# EAGLE design 1881! (EAGLE 6.2)
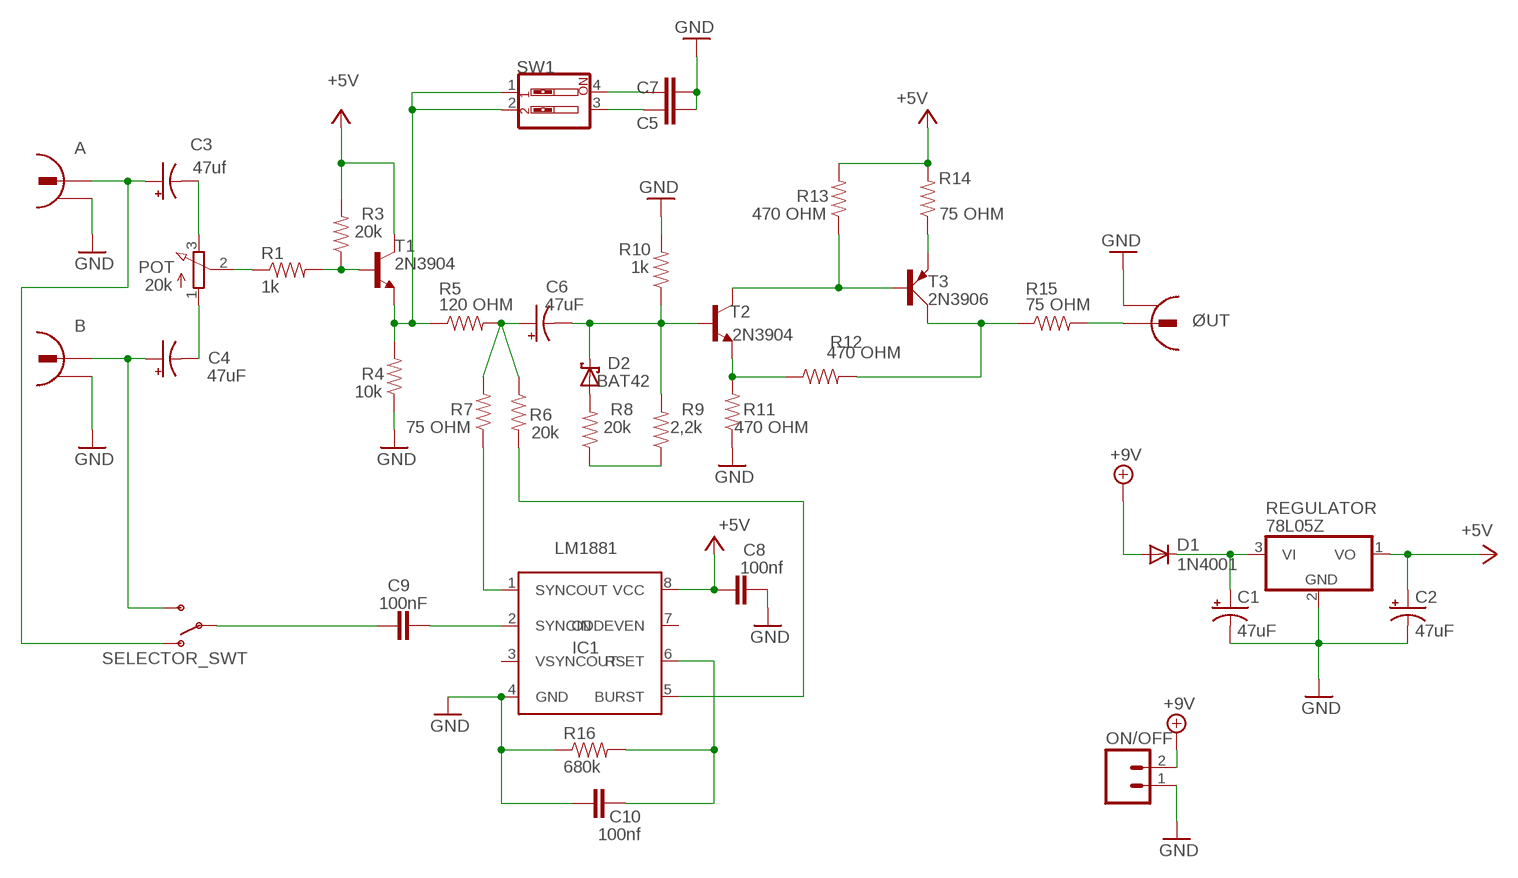
[diagram p0: schematic, sheet 1]

## Parts
A  736880-49  [736880-49]
B  736880-49  [736880-49]
C1  47uF  CAP_POLPTH2  [CPOL-RADIAL-10UF-25V]
C2  47uF  CAP_POLPTH2  [CPOL-RADIAL-10UF-25V]
C3  47uf  CAP_POLPTH2  [CPOL-RADIAL-10UF-25V]
C4  47uF  CAP_POLPTH2  [CPOL-RADIAL-10UF-25V]
C5  CAPPTH2  [CAP-PTH-SMALL2]
C6  47uF  CAP_POLPTH2  [CPOL-RADIAL-10UF-25V]
C7  CAPPTH2  [CAP-PTH-SMALL2]
C8  100nf  CAPPTH2  [CAP-PTH-SMALL2]
C9  100nF  CAPPTH2  [CAP-PTH-SMALL2]
C10  100nf  CAPPTH2  [CAP-PTH-SMALL2]
D1  1N4001  1N4148DO35-7  [DO35-7]
D2  BAT42  [DO35-10]
IC1  LM1881  [DIL08]
ON/OFF  M02POLAR_LOCK  [MOLEX-1X2_LOCK]
POT  20k  3RP/1610N  [3RP/1610N]
R1  1k  RESISTORPTH-1/6W  [1/6W-RES]
R3  20k  RESISTORPTH-1/6W  [1/6W-RES]
R4  10k  RESISTORPTH-1/6W  [1/6W-RES]
R5  120 OHM  RESISTORPTH-1/6W  [1/6W-RES]
R6  20k  RESISTORPTH-1/6W  [1/6W-RES]
R7  75 OHM  RESISTORPTH-1/6W  [1/6W-RES]
R8  20k  RESISTORPTH-1/6W  [1/6W-RES]
R9  2,2k  RESISTORPTH-1/6W  [1/6W-RES]
R10  1k  RESISTORPTH-1/6W  [1/6W-RES]
R11  470 OHM  RESISTORPTH-1/6W  [1/6W-RES]
R12  470 OHM  RESISTORPTH-1/6W  [1/6W-RES]
R13  470 OHM  RESISTORPTH-1/6W  [1/6W-RES]
R14  75 OHM  RESISTORPTH-1/6W  [1/6W-RES]
R15  75 OHM  RESISTORPTH-1/6W  [1/6W-RES]
R16  680k  RESISTORPTH-1/6W  [1/6W-RES]
REGULATOR  78L05Z  [TO92]
SELECTOR_SWT  SWITCH-SPSTPTH  [SWITCH-SPDT]
SW1  SW_DIP-2  [DIPSWITCH-02]
T1  2N3904  [TO92]
T2  2N3904  [TO92]
T3  2N3906  [TO92D]
ØUT  736880-49  [736880-49]

## Nets
+5V: C2.1(+) C8.1 IC1.8(VCC) R3.2 R13.2 R14.2 REGULATOR.1(VO) T1.1(C)
+9V: D1.A ON/OFF.2
GND: A.2 B.2 C1.2(-) C2.2(-) C5.2 C7.2 C8.2 C10.1 IC1.4(GND) ON/OFF.1 R4.1 R10.2 R11.1 R16.1 REGULATOR.2(GND) ØUT.2
N$1: C1.1(+) D1.C REGULATOR.3(VI)
N$2: B.1 C4.1(+) SELECTOR_SWT.3(S)
N$3: A.1 C3.1(+) SELECTOR_SWT.1(O)
N$4: C3.2(-) POT.3(E)
N$5: C4.2(-) POT.1(A)
N$6: POT.2(S) R1.1
N$7: R1.2 R3.1 T1.2(B)
N$8: C6.1(+) R5.2 R6.1 R7.2
N$9: IC1.1(SYNCOUT) R7.1
N$10: D2.A R8.2
N$11: C6.2(-) D2.C R9.2 R10.1 T2.2(B)
N$12: R8.1 R9.1
N$13: R11.2 R12.1 T2.3(E)
N$14: R13.1 T2.1(C) T3.B
N$15: R14.1 T3.E
N$16: R4.2 R5.1 SW1.1 SW1.2 T1.3(E)
N$17: R12.2 R15.1 T3.C
N$18: R15.2 ØUT.1
N$19: C5.1 SW1.3
N$20: C7.1 SW1.4
N$21: IC1.5(BURST) R6.2
N$22: C9.2 IC1.2(SYNCIN)
N$23: C10.2 IC1.6(RSET) R16.2
N$24: C9.1 SELECTOR_SWT.2(P)
Unconnected: A.2@2 B.2@2 IC1.3(VSYNCOUT) IC1.7(ODDEVEN) ØUT.2@2

## Library data of the parts
A B ØUT = con-conrad:736880-49: Cinch Connector ( RCA Jack )
C1-C4 C6 = SparkFun:CAP_POL: Capacitor Polarized These are standard SMD and PTH capacitors. Normally 10uF, 47uF, and 100uF in electrolytic and tantalum varieties. Always verify the external diameter of the through hole cap, it varies with capacity, voltage, and manufacturer. The EIA devices should be standard.
C5 C7-C10 = SparkFun:CAP: Capacitor Standard 0603 ceramic capacitor, and 0.1" leaded capacitor.
D1 = diode:1N4148: DIODE high speed (Philips)
D2 = diode:BAT42: DIODE barrier diode
IC1 = lm1881:LM1881
ON/OFF = SparkFun:M02: Header 2 Standard 2-pin 0.1" header. Use with straight break away headers (SKU : PRT-00116), right angle break away headers (PRT-00553), swiss pins (PRT-00743), machine pins (PRT-00117), and female headers (PRT-00115). Molex polarized connector foot print use with SKU : PRT-08233 with associated crimp pins and housings.
POT = pot:3RP/1610N: 16mm Potentiometer one level Source: http://www.alphapotentiometers.net/html/16mm_pot_2.html
R1 R3-R16 = SparkFun:RESISTOR: Resistor Basic schematic elements and footprints for 0603, 1206, and PTH resistors.
REGULATOR = linear:78*: Positive VOLTAGE REGULATOR Source: http://cache.national.com/ds/LM/LM78L05.pdf http://www.fairchildsemi.com/ds/LM/LM7805.pdf
SELECTOR_SWT = SparkFun:SWITCH-SPST: SPST Switch Simple slide switch. Spark Fun Electronics SKU : COM-00102
SW1 = SparkFun:SW_DIP-2: DIP SWITCH
T1 T2 = transistor:2N3904: NPN TRANSISTOR
T3 = transistor-small-signal:2N3906: PNP TRANSISTOR

## Board
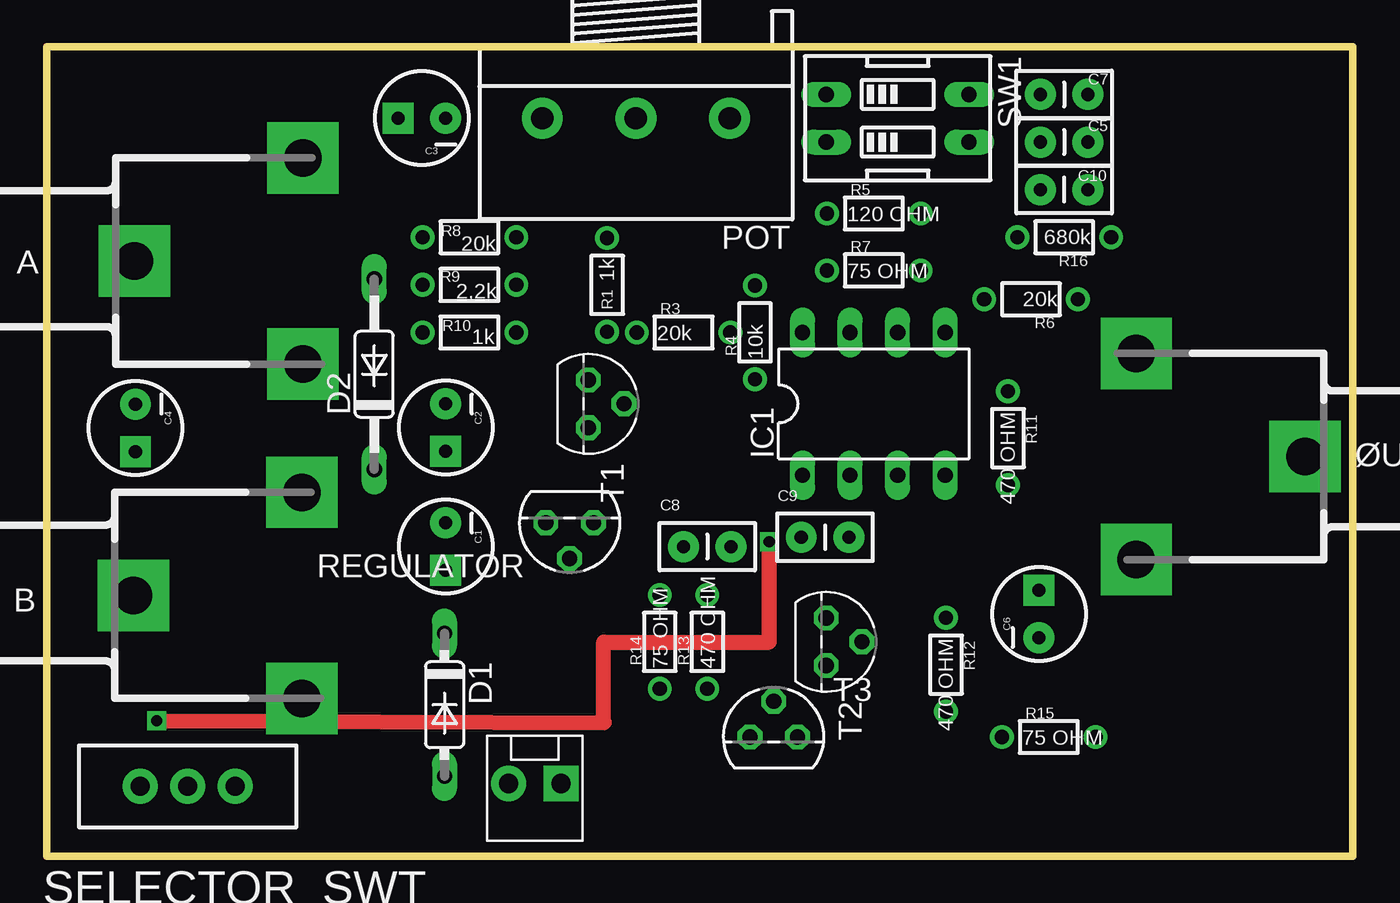
[diagram p1: board, top side]
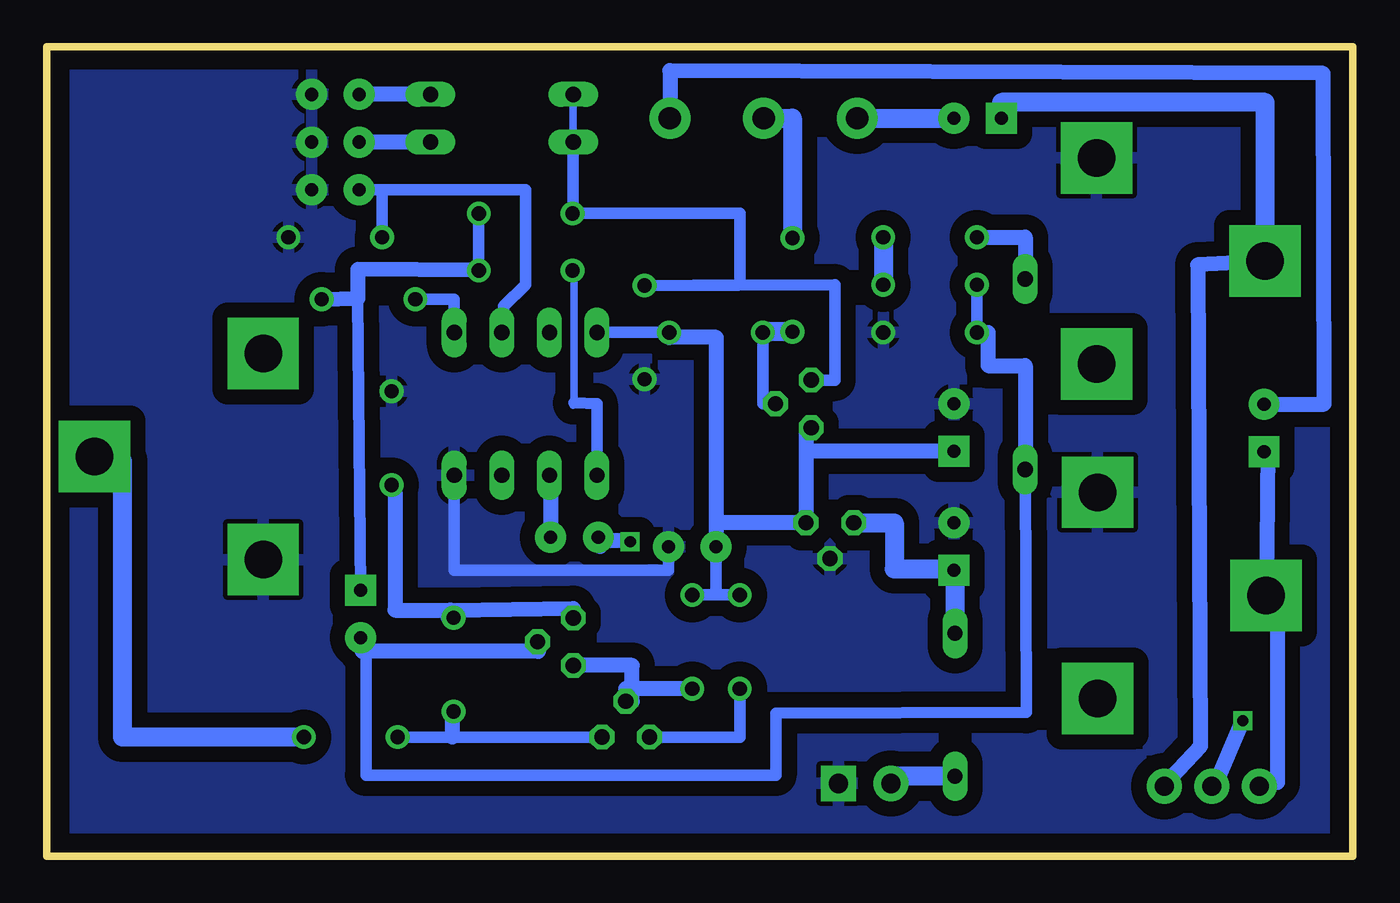
[diagram p2: board, bottom side, seen from below]

Size 69.71 x 43.18 mm. Coordinates in mm from the lower left corner, seen from the top.
Outline: 69.71,43.18 69.71,0 0,0 0,43.18 69.71,43.18
Copper layers (1*16): Top 0.035mm / dielectric 1.5mm / Bottom 0.035mm
Design rules: minimum track width 10mil, minimum drill 24mil, track to track 8mil, track to pad 8mil, pad to pad 8mil, via to via 8mil, smd to smd 8mil, copper to edge 40mil, drill to drill 8mil, minimum pad ring 10mil, minimum via ring 8mil, stop-mask expansion 4mil, vias tented up to drill 0mil, thermal gap 10mil

### Footprints (pad centres in the part's own frame; a part is rotated, then mirrored left to right if it is on the bottom)
736880-49 = drill 2 pad 3.81 square: 1 -3.92,0; 2 5.08,5.5; 2@2 5.08,-5.5
CPOL-RADIAL-10UF-25V = drill 0.7 pad 1.651 square: 1 1.27,0 | drill 0.7 pad 1.651: 2 -1.27,0
CAP-PTH-SMALL2 = drill 0.7 pad 1.651: 1 0,0; 2 2.54,0
DO35-7 = drill 0.813 long: A 3.81,0; C -3.81,0
DO35-10 = drill 0.813 long: A 5.08,0; C -5.08,0
DIL08 = drill 0.813 long: 1 -3.81,-3.81; 2 -1.27,-3.81; 3 1.27,-3.81; 4 3.81,-3.81; 5 3.81,3.81; 6 1.27,3.81; 7 -1.27,3.81; 8 -3.81,3.81
MOLEX-1X2_LOCK = drill 1.016 pad 1.88 square: 1 -0.127,0 | drill 1.016 pad 1.88: 2 2.667,0
3RP/1610N = drill 1.2 pad 2.184: 1 -5,0; 2 0,0; 3 5,0
1/6W-RES = drill 0.762: 1 -2.5,0; 2 2.5,0
TO92 = drill 0.813 octagon: 1 -1.27,0; 2 0,1.905; 3 1.27,0
SWITCH-SPDT = drill 1.016 pad 1.88: 1 0,2.54; 2 0,0; 3 0,-2.54
DIPSWITCH-02 = drill 0.813 long: 1 -1.27,-3.81; 2 1.27,-3.81; 3 1.27,3.81; 4 -1.27,3.81
TO92' = drill 0.813 octagon: 1 1.27,0; 2 0,1.905; 3 -1.27,0
TO92D = drill 0.813 octagon: B 0,1.905; C 1.27,0; E -1.27,0

### Placement (x,y rotation side)
A  8.59,31.75 0 top
B  8.54,13.91 0 top
C1  21.29,16.51 270 top
C2  21.29,22.86 270 top
C3  20.02,39.37 180 top
C4  4.73,22.84 270 top
C5  53.04,38.1 0 top
C6  52.96,12.92 90 top
C7  53.04,40.64 0 top
C8  33.99,16.51 0 top
C9  40.27,17.01 0 top
C10  55.58,35.56 180 top
D1  21.23,8.07 270 top
D2  17.48,25.71 90 top
IC1  44.15,24.13 0 top
ON/OFF  27.32,3.87 180 top
POT  31.45,39.37 180 top
R1  29.91,30.48 270 top
R3  33.99,27.94 0 top
R4  37.8,27.94 90 top
R5  44.15,34.29 0 top
R6  52.54,29.71 180 top
R7  44.15,31.25 0 top
R8  22.56,33.02 180 top
R9  22.56,30.48 180 top
R10  22.56,27.94 0 top
R11  51.31,22.3 270 top
R12  48,10.21 270 top
R13  35.26,11.43 90 top
R14  32.72,11.43 90 top
R15  53.49,6.35 0 top
R16  54.31,33.02 180 top
REGULATOR  27.91,17.78 180 top
SELECTOR_SWT  7.52,3.72 270 top
SW1  45.42,39.37 270 top
T1  2N3904  [TO92']  28.91,24.13 270 top
T2  2N3904  [TO92']  41.61,11.43 270 top
T3  38.8,6.35 0 top
ØUT  63.24,21.32 180 top

### Tracks (layer width: path | path; a pad name or v marks a point on that pad's centre or on a via)
+5V
  Bottom 0.61: IC1.8 R3.2 | R14.2 33.99,13.93 | 33.99,13.93 R13.2 | C8.1 33.99,13.93
  Bottom 0.813: C8.1 33.97,16.51 33.97,17.78 | 33.97,17.78 33.97,27.67 36.49,27.67 R3.2 | 33.97,17.78 REGULATOR.1 29.18,21.59 | C2.1 29.18,21.59 | T1.1 29.18,22.86 29.18,21.59
+9V
  Bottom 1.016: D1.A 24.65,4.26 ON/OFF.2
GND
  Bottom 0.61: IC1.4 47.96,15.24 36.53,15.24 C8.2
  pour Bottom (isolate 0.813): -2.84,44.45 75.9,44.45 75.9,-1.27 -2.84,-1.27
N$1
  Bottom 1.016: REGULATOR.3 24.47,17.78 24.47,15.32 21.29,15.32 C1.1 21.23,15.24 D1.C
N$2
  Bottom 0.813: C4.1 4.67,21.72 4.52,21.72 B.1 4.02,13.91 4.02,3.92 4.98,3.92 SELECTOR_SWT.3
N$3
  Bottom 0.813: A.1 8.27,31.55 8.12,5.87 9.71,4.17 SELECTOR_SWT.1
  Bottom 1.016: A.1 4.67,40.22 18.75,40.22 C3.1
N$4
  Bottom 1.016: POT.3 C3.2
N$5
  Bottom 0.813: C4.2 1.52,24.11 1.57,41.76 36.45,41.91 POT.1
N$6
  Bottom 1.016: POT.2 29.91,39.37 R1.1
N$7
  Bottom 0.61: T1.2 31.49,24.13 R3.1
  Bottom 1.016: R1.2 31.49,27.98 R3.1
N$8
  Bottom 0.61: R5.2 R7.2 | 53.11,29.76 C6.1
  Bottom 0.813: R7.2 53.11,31.3 53.11,29.76 R6.1
N$9
  Bottom 0.406: 41.62,24.05 41.57,24.18 41.57,31.25 R7.1
  Bottom 0.61: 41.57,24.18 40.34,24.13 IC1.1
N$10
  Bottom 0.813: R8.2 17.48,33.02 D2.A
N$11
  Bottom 0.61: R9.2 R10.1 | D2.C 17.43,7.67 30.79,7.62 30.79,4.31 52.67,4.31 52.67,10.92 52.87,10.92
  Bottom 0.813: R10.1 19.47,27.94 19.47,26.17 17.48,26.17 D2.C | C6.2 52.87,11.1 52.87,10.92 43.47,10.92 43.47,11.43 T2.2
  Bottom 1.016: C6.2 52.97,11.75
N$12
  Bottom 0.254: 25.1,30.48 R9.1
  Bottom 1.016: 25.1,33.02 R8.1 R9.1
N$13
  Bottom 0.813: R11.2 51.12,19.4 51.12,13.12 48.17,13.12 | 48.17,13.12 41.61,13.22 T2.3 | R12.1 48.27,12.71 48.17,13.12
N$14
  Bottom 0.813: R13.1 38.8,8.93 T3.B 38.47,8.26 38.47,10.17 T2.1
N$15
  Bottom 0.61: R14.1 32.72,6.35 T3.E
N$16
  Bottom 0.406: SW1.1 SW1.2
  Bottom 0.61: T1.3 27.64,25.4 27.64,30.48 R4.2 32.72,30.48 32.72,34.29 R5.1 41.61,34.29 SW1.2
N$17
  Bottom 0.61: T3.C 48.07,6.35 R15.1
  Bottom 0.813: R12.2 48.07,7.71 48.07,6.35
N$18
  Bottom 1.016: R15.2 65.67,6.35 65.67,21.07 67.16,21.07 ØUT.1
N$19
  Bottom 0.813: SW1.3 C5.1
N$20
  Bottom 0.813: SW1.4 C7.1
N$21
  Bottom 0.61: IC1.5 47.96,29.71 R6.2
N$22
  Bottom 0.813: IC1.2 42.81,20.32 C9.2
N$23
  Bottom 0.61: IC1.6 45.32,29.33 44.15,30.48 44.15,35.56 C10.2 51.81,35.56 R16.2
N$24  (via drill 0.6)
  Top 0.813: v5.87,7.22 29.77,7.12 29.72,7.12 29.72,11.42 38.57,11.42 v38.57,16.77 38.57,16.82
  Bottom 0.813: SELECTOR_SWT.2 7.37,3.72 v5.87,7.22 | 40.17,16.52 40.17,17.01 C9.1 40.27,16.82 38.62,16.82 38.62,16.77 v38.57,16.77